# Altium schematic sheet Sonar.SchDoc
size A
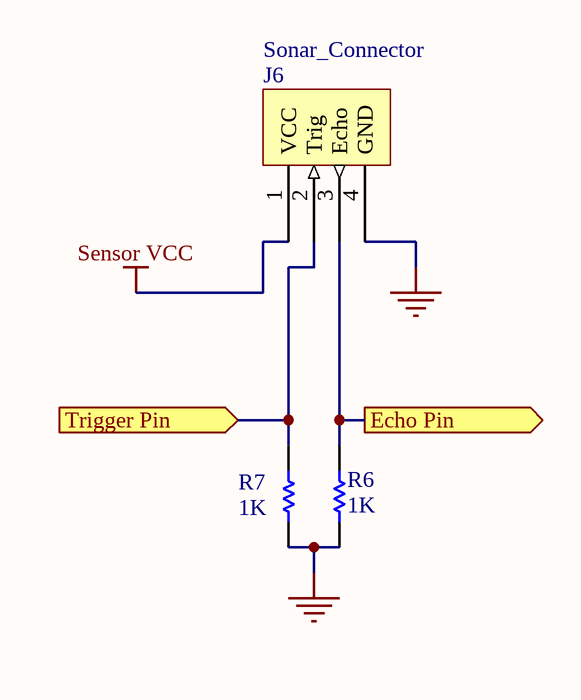
[diagram p0: Sonar.SchDoc]

## Parts
J6  Sonar_Connector  [SONAR CONNECTOR]
R6  1K  [1608 / 0603]
R7  1K  [1608 / 0603]

## Ports
Echo Pin (out), Trigger Pin (in)

## Nets
GND: J6.4(GND) R6.1 R7.1
Sensor VCC: J6.1(VCC)
Echo Pin: J6.3(Echo) R6.2 ; port Echo Pin
Trigger Pin: J6.2(Trig) R7.2 ; port Trigger Pin

## Library data of the parts
J6 = Sonar_Connector: Female Embase 4 contacts; fournisseur: Farnell; reffournisseur: 1845959; fabricant: TE CONNECTIVITY / AMP; reffabricant: 5-534237-2
R6 R7 = Res1: Resistor; Published: 8-Jun-2000; LatestRevisionDate: 17-Jul-2002; LatestRevisionNote: Re-released for DXP Platform.; PackageReference: AXIAL-0.3; Publisher: Altium Limited; PackageDescription: Axial Device, Thru-Hole; 2 Leads; 0.3 in Pin Spacing; Value: 1K